# Altium project HEART_PCB.PrjPcb
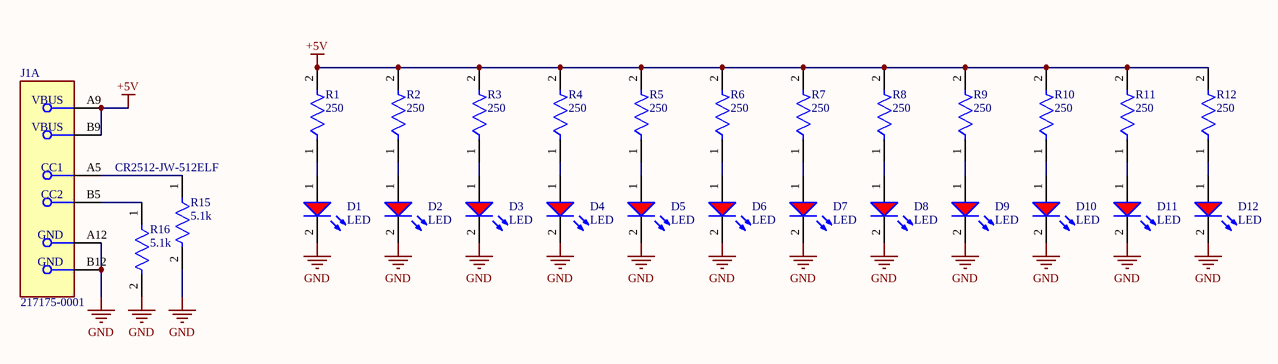
[diagram p0: Heart.SchDoc]
1 sheet, 27 parts. Net scope: global (net labels, ports and power ports of the same name join across sheets).
Board file: Heart.PcbDoc

## Sheet Heart.SchDoc
size B; SheetNumber: 1; SheetTotal: 1; SPICEModelCacheTFSEEEFS: <root> / <DocumentId>TFSEEEFS</DocumentId> / <CacheFrame Number="0"> / <Model Name="diode" Kind="MDL"> / <Text>.MODEL diode D ()</Text> / </Model> / </CacheFrame> / </root>

### Parts
D1  LED  [WL-TMRC_D3.95H5.3]
D2  LED  [WL-TMRC_D3.95H5.3]
D3  LED  [WL-TMRC_D3.95H5.3]
D4  LED  [WL-TMRC_D3.95H5.3]
D5  LED  [WL-TMRC_D3.95H5.3]
D6  LED  [WL-TMRC_D3.95H5.3]
D7  LED  [WL-TMRC_D3.95H5.3]
D8  LED  [WL-TMRC_D3.95H5.3]
D9  LED  [WL-TMRC_D3.95H5.3]
D10  LED  [WL-TMRC_D3.95H5.3]
D11  LED  [WL-TMRC_D3.95H5.3]
D12  LED  [WL-TMRC_D3.95H5.3]
J1  217175-0001  [FP-217175-0001-MFG]  (part A of 2)
R1  250  [FP-TFCR1206-IPC_B]
R2  250  [FP-TFCR1206-IPC_B]
R3  250  [FP-TFCR1206-IPC_B]
R4  250  [FP-TFCR1206-IPC_B]
R5  250  [FP-TFCR1206-IPC_B]
R6  250  [FP-TFCR1206-IPC_B]
R7  250  [FP-TFCR1206-IPC_B]
R8  250  [FP-TFCR1206-IPC_B]
R9  250  [FP-TFCR1206-IPC_B]
R10  250  [FP-TFCR1206-IPC_B]
R11  250  [FP-TFCR1206-IPC_B]
R12  250  [FP-TFCR1206-IPC_B]
R15  5.1k  [FP-TFCR2512-IPC_A]
R16  5.1k  [FP-TFCR2512-IPC_A]

### Nets
+5V: J1.A9(VBUS) J1.B9(VBUS) R1.2 R2.2 R3.2 R4.2 R5.2 R6.2 R7.2 R8.2 R9.2 R10.2 R11.2 R12.2
GND: D1.2(K) D2.2(K) D3.2(K) D4.2(K) D5.2(K) D6.2(K) D7.2(K) D8.2(K) D9.2(K) D10.2(K) D11.2(K) D12.2(K) J1.A12(GND) J1.B12(GND) R15.2 R16.2
NetD1_1: D1.1(A) R1.1
NetD2_1: D2.1(A) R2.1
NetD3_1: D3.1(A) R3.1
NetD4_1: D4.1(A) R4.1
NetD5_1: D5.1(A) R5.1
NetD6_1: D6.1(A) R6.1
NetD7_1: D7.1(A) R7.1
NetD8_1: D8.1(A) R8.1
NetD9_1: D9.1(A) R9.1
NetD10_1: D10.1(A) R10.1
NetD11_1: D11.1(A) R11.1
NetD12_1: D12.1(A) R12.1
NetJ1_A5: J1.A5(CC1) R15.1
NetJ1_B5: J1.B5(CC2) R16.1

### Notes on the sheet
- CR2512-JW-512ELF

### Library data of the parts
D1-D12 = CMP-1488-00002-2: NexarPartId: 29717803; Luminous Intensity: 35mcd; Forward Current: 100mA; Wavelength: 630nm; Max Reverse Voltage (DC): 5V; Peak Wavelength: 650nm; Lens Size: 3mm; Dominant Wavelength: 640nm; Test Current: 20mA; Viewing Angle: 60°; Color: Red; Forward Voltage: 2.2V; Lens Style: Circular, Diffused, Round; Height: 5.3mm; RoHS: Compliant; Width: 3mm; REACH SVHC: Unknown; Max Operating Temperature: 85°C; Mount: Through Hole; Min Operating Temperature: -40°C; Case/Package: Radial; Packaging: Bulk; Length: 3mm
J1 = CMP-04767-000026-1: CONN RCP USB2.0 C 6+18P SMD RA
R1-R12 = CMP-250906-243926-1: RES Thin Film, 100Ω, 0.1%, 0.125W, 25ppm/°C, 1206
R15 R16 = CMP-250906-200568-1: RES Thin Film, 5.1kΩ, 0.5%, 0.5W, 25ppm/°C, 2512